# Altium schematic sheet PushButtonPower.SchDoc
size A4; SheetNumber: 1; SheetTotal: 1
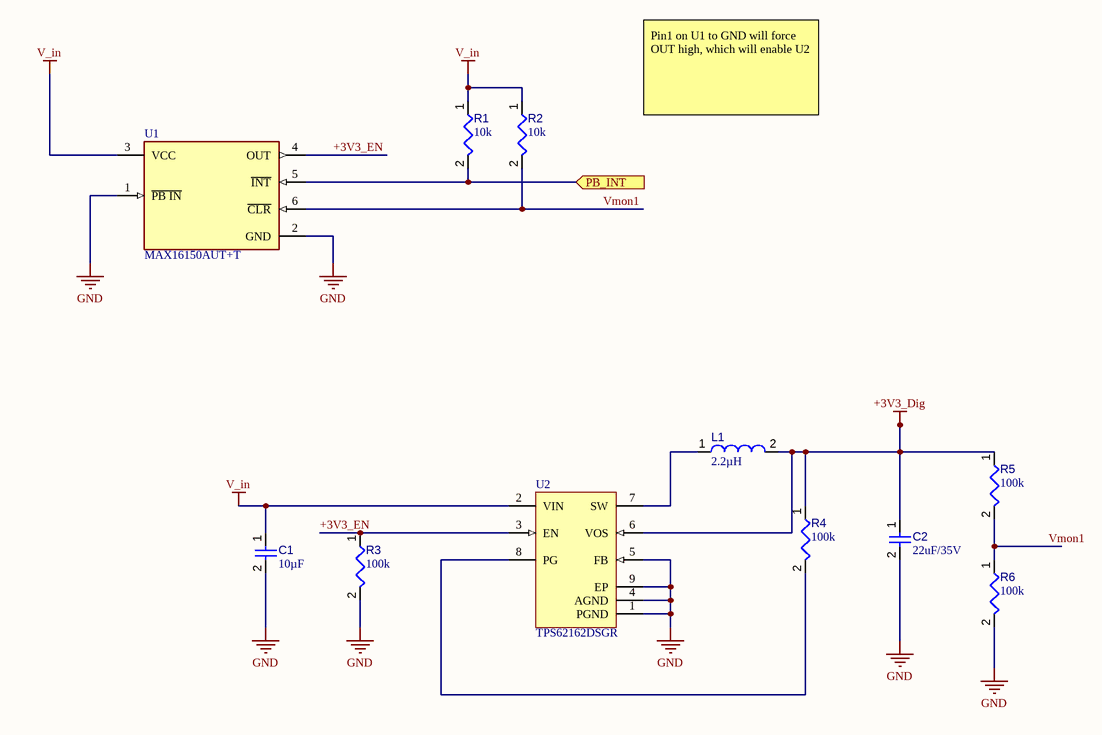
[diagram p0: PushButtonPower.SchDoc]

## Parts
C1  value 10µF  [CAPC0805(2012)145_L]  (hidden comment: Capacitor 10µF +/-20% 25V 0805)
C2  value 22uF/35V  [CAPC0805(2012)145_L]  (hidden comment: Capacitor 10µF +/-20% 25V 0805)
L1  value 2.2µH  [INDC2520X100X60NL20T20]  (hidden comment: LQM2HPN2R2MG0L)
R1  value 10k  [RESC0402(1005)_L]  (hidden comment: Resistor 10K  +/-1 % 0402 63 mW)
R2  value 10k  [RESC0402(1005)_L]  (hidden comment: Resistor 10K  +/-1 % 0402 63 mW)
R3  value 100k  [RESC0402(1005)_L]  (hidden comment: Resistor 10K  +/-1 % 0402 63 mW)
R4  value 100k  [RESC0402(1005)_L]  (hidden comment: Resistor 10K  +/-1 % 0402 63 mW)
R5  value 100k  [RESC0402(1005)_L]  (hidden comment: Resistor 10K  +/-1 % 0402 63 mW)
R6  value 100k  [RESC0402(1005)_L]  (hidden comment: Resistor 10K  +/-1 % 0402 63 mW)
U1  MAX16150AUT+T  [FP-U6-1-MFG]
U2  TPS62162DSGR  [DSG0008A_V]

## Ports
PB_INT (in)

## Nets
+3V3_Dig: C2.1 L1.2 R4.1 R5.1 U2.6(VOS)
GND: C1.2 C2.2 R3.2 R6.2 U1.1(~{PB_IN}) U1.2(GND) U2.1(PGND) U2.4(AGND) U2.5(FB) U2.9(EP)
V_in: C1.1 R1.1 R2.1 U1.3(VCC) U2.2(VIN)
+3V3_EN: R3.1 U1.4(OUT) U2.3(EN)
PB_INT: R1.2 U1.5(~{INT}) ; port PB_INT
Vmon1: R2.2 R5.2 R6.1 U1.6(~{CLR})
NetL1_1: L1.1 U2.7(SW)
NetR4_2: R4.2 U2.8(PG)

## Notes on the sheet
- Pin1 on U1 to GND will force OUT high, which will enable U2

## Library data of the parts
C1 C2 = CMP-001-00079-4: Chip Capacitor, 10µF +/-20%, 25V, 0805, Thickness 1.45 mm; Tolerance: 10%; Max Operating Temperature: 85°C; Case/Package: 0805; Voltage Rating: 25V; Min Operating Temperature: -55°C; Mounting Technology: SMT; Pins: 2
L1 = CMP-006-00009-6: Chip Inductor, 2.2 uH, +/- 20%, -55 to 125 degC, 1008 (2520 Metric), RoHS, Tape and Reel; Manufacturer: Murata; Self Resonant Frequency: 40MHz; Current Rating: 1.3A; Core Material: Ferrite; Shielding: Shielded; Package Description: 2-Pin Surface Mounted Device, Body 2.5 x 2 mm; Tolerance: 20%; Max Operating Temperature: 125°C; Mounting Technology: SM; Package Reference: 1008; Case/Package: 1008; RoHS Compliant: True; Package Quantity: 3000; Packaging: TapeandReel; Min Operating Temperature: -55°C; Datasheet URL: http://psearch.en.murata.com/inductor/product/LQM2HPN2R2MG0%23.pdf; Datasheet Version: Aug-16
R1-R6 = CMP-009-00149-3: Chip Resistor, 10 kOhms, +/-1 %, 63 mW, -55 to 125 degC, 0402; Power: 63mW; Tolerance: 1%; Min Operating Temperature: -55°C; Case/Package: 0402; Max Operating Temperature: 155°C; Pins: 2
U1 = CMP-05723-001129-1: IC SUPERVISOR 1 CHANNEL SOT23-6
U2 = CMP-0323-00316-3: Buck Step Down Regulator with 3 to 17 V Input and 3.3 V Output, -40 to 85 degC, 8-Pin WSON (DSG), Green (RoHS & no Sb/Br); Manufacturer: Texas Instruments; SubFamily: Step-Down Regulator; Synchronous Rectification: TRUE; Vout(Max)(V): 3.3; Regulated Outputs(#): 1; Switch Current Limit(Typ)(A): 1.8; Duty Cycle(Max)(%): 100; Iq(Typ)(mA): 0.017; Rating: Catalog; Vin(Min)(V): 3; Vin(Max)(V): 17; ComponentLink2URL: http://www.ti.com/litv/pdf/mpds308a; ComponentLink3URL: Samples URL:http://www.ti.com/product/tps62162#samples; Eco-Plan: Green (RoHS & no Sb/Br); PackageDescription: 8-Pin Plastic Small Outline No-Lead, 2 x 2 x 0.8 mm Body, 0.5 mm Pitch, Exposed Pad; DatasheetVersion: SLVSAM2A; Topology: Buck; PartNumber: TPS62162DSGR; PackageReference: DSG0008A; ComponentLink1URL: http://www.ti.com/general/docs/lit/getliterature.tsp?genericPartNumber=TPS62162&fileType=pdf; PackageVersion: revB, Oct-2010; Mounting Technology: Surface Mount; Code_JEDEC: MO-229; Iout(Max)(A): 1; ComponentLink1Description: Datasheet; ComponentLink2Description: Package Specification; Vout(Min)(V): 3.3; ComponentLink3Description: URL Link1; Preset Vout(V): 3.3